# EAGLE schematic codec_AD1938 (EAGLE 9.6.2)

## Sheet 1 of 2
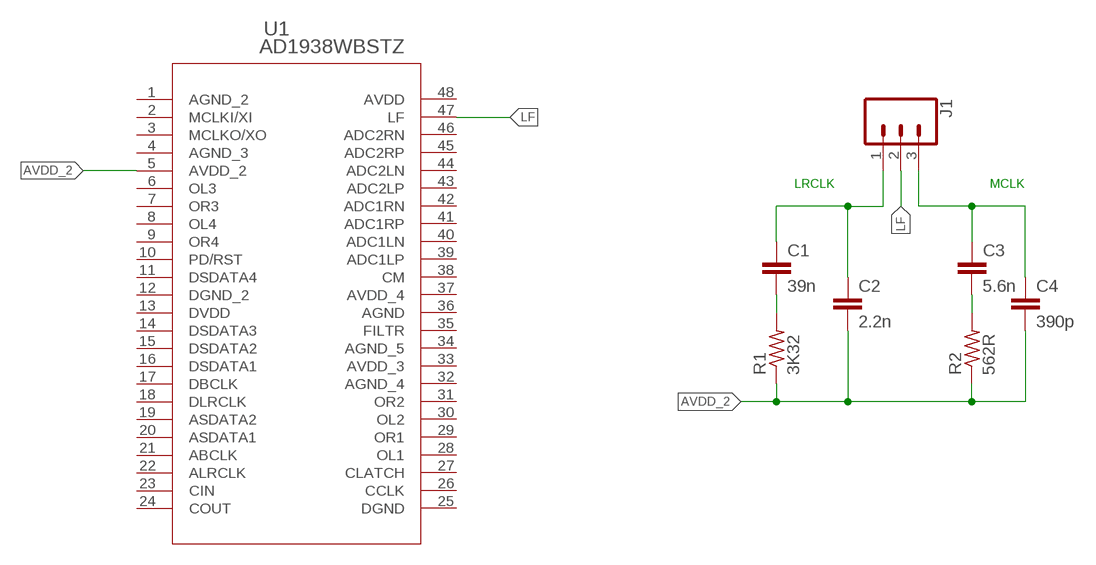
[diagram p0: schematic, sheet 1]

### Parts
C1  39n  C-EUC0603  [C0603]
C2  2.2n  C-EUC0603  [C0603]
C3  5.6n  C-EUC0603  [C0603]
C4  390p  C-EUC0603  [C0603]
J1  CONN_03LOCK_LONGPADS  [1X03_LOCK_LONGPADS]
R1  3K32  R-US_R0603  [R0603]
R2  562R  R-US_R0603  [R0603]
U1  AD1938WBSTZ  [ST_48_ADI]

### Nets
AVDD_2: C2.2 C4.2 R1.1 R2.1 U1.5(AVDD_2)
LF: C1.1 C2.1 C3.1 C4.1 J1.1 J1.2 J1.3 U1.47(LF)
N$1: C1.2 R1.2
N$4: C3.2 R2.2
Unconnected: U1.1(AGND_2) U1.2(MCLKI/XI) U1.3(MCLKO/XO) U1.4(AGND_3) U1.6(OL3) U1.7(OR3) U1.8(OL4) U1.9(OR4) U1.10(PD/RST) U1.11(DSDATA4) U1.12(DGND_2) U1.14(DSDATA3) U1.15(DSDATA2) U1.16(DSDATA1) U1.17(DBCLK) U1.18(DLRCLK) U1.19(ASDATA2) U1.20(ASDATA1) U1.21(ABCLK) U1.22(ALRCLK) U1.23(CIN) U1.24(COUT) U1.25(DGND) U1.26(CCLK) U1.27(CLATCH) U1.28(OL1) U1.29(OR1) U1.30(OL2) U1.31(OR2) U1.32(AGND_4) U1.34(AGND_5) U1.35(FILTR) U1.36(AGND) U1.38(CM) U1.39(ADC1LP) U1.40(ADC1LN) U1.41(ADC1RP) U1.42(ADC1RN) U1.43(ADC2LP) U1.44(ADC2LN) U1.45(ADC2RP) U1.46(ADC2RN)

### Notes on the sheet
- LRCLK | MCLK

## Sheet 2 of 2: DAC Output Buffers
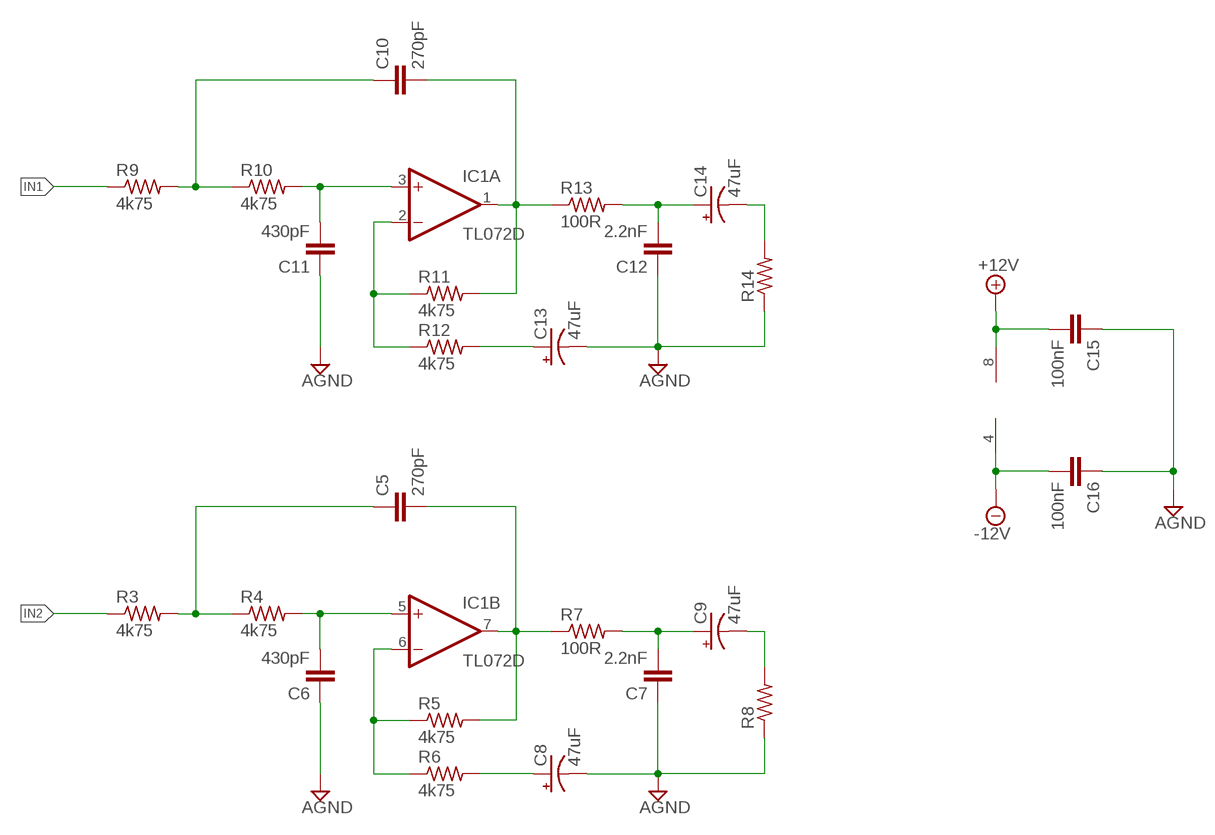
[diagram p1: schematic, sheet 2]

### Parts
C5  270pF  C-EUC0603  [C0603]
C6  430pF  C-EUC0603  [C0603]
C7  2.2nF  C-EUC0603  [C0603]
C8  47uF  CPOL-USUD-5X5,8  [UD-5X5,8_NICHICON]
C9  47uF  CPOL-USUD-5X5,8  [UD-5X5,8_NICHICON]
C10  270pF  C-EUC0603  [C0603]
C11  430pF  C-EUC0603  [C0603]
C12  2.2nF  C-EUC0603  [C0603]
C13  47uF  CPOL-USUD-5X5,8  [UD-5X5,8_NICHICON]
C14  47uF  CPOL-USUD-5X5,8  [UD-5X5,8_NICHICON]
C15  100nF  C-EUC0603  [C0603]
C16  100nF  C-EUC0603  [C0603]
IC1  TL072D  [SO08]
R3  4k75  R-US_R0603  [R0603]
R4  4k75  R-US_R0603  [R0603]
R5  4k75  R-US_R0603  [R0603]
R6  4k75  R-US_R0603  [R0603]
R7  100R  R-US_R0603  [R0603]
R8  R-US_R0603  [R0603]
R9  4k75  R-US_R0603  [R0603]
R10  4k75  R-US_R0603  [R0603]
R11  4k75  R-US_R0603  [R0603]
R12  4k75  R-US_R0603  [R0603]
R13  100R  R-US_R0603  [R0603]
R14  R-US_R0603  [R0603]

### Nets
+12V: C15.2 IC1.8(P:V+)
-12V: C16.2 IC1.4(P:V-)
AGND: C6.1 C7.1 C8.- C11.1 C12.1 C13.- C15.1 C16.1 R8.1 R14.1
IN1: R9.1
IN2: R3.1
N$2: C5.1 R3.2 R4.1
N$3: C6.2 IC1.5(B:+IN) R4.2
N$5: C5.2 IC1.7(B:OUT) R5.2 R7.1
N$6: IC1.6(B:-IN) R5.1 R6.1
N$7: C7.2 C9.+ R7.2
N$8: C9.- R8.2
N$9: C8.+ R6.2
N$10: C10.1 R9.2 R10.1
N$11: C11.2 IC1.3(A:+IN) R10.2
N$12: C10.2 IC1.1(A:OUT) R11.2 R13.1
N$13: IC1.2(A:-IN) R11.1 R12.1
N$14: C12.2 C14.+ R13.2
N$15: C13.+ R12.2
N$16: C14.- R14.2

## Power pins joined to a net without a drawn wire
AVDD: U1.48(AVDD)
AVDD_3: U1.33(AVDD_3)
AVDD_4: U1.37(AVDD_4)
DVDD: U1.13(DVDD)

## Library data of the parts
C1-C7 C10-C12 C15 C16 = rcl:C-EU: CAPACITOR, European symbol; SPICEPREFIX: C
C8 C9 C13 C14 = rcl:CPOL-US: POLARIZED CAPACITOR, American symbol; SPICEPREFIX: C
IC1 = linear:TL072: OP AMP
J1 = SparkFun-Connectors:CONN_03: Multi connection point. Often used as Generic Header-pin footprint for 0.1 inch spaced/style header connections On any of the 0.1 inch spaced packages, you can populate with these: Break Away Headers - Straight <https://www.sparkfun.com/products/116> (PRT-00116) Break Away Male Headers - Right Angle <https://www.sparkfun.com/products/553> (PRT-00553) Female Headers <https://www.sparkfun.com/products/115> (PRT-00115) Break Away Headers - Machine Pin <https://www.sparkfun.com/products/117> (PRT-00117) Break Away Female Headers - Swiss Machine Pin <https://www.sparkfun.com/products/743> (PRT-00743) Stackable Header - 3 Pin (Female, 0.1") <https://www.sparkfun.com/products/13875> (PRT-13875) For SCREWTERMINALS and SPRING TERMINALS visit here: Screw Terimnals on SparkFun.com <https://www.sparkfun.com/search/results?term=Screw+Terminals> (5mm/3.5mm/2.54mm spacing) This device is also useful as a general connection point to wire up your design to another part of your project. Our various solder wires solder well into these plated through hole pads. Hook-Up Wire - Assortment (Stranded, 22 AWG) <https://www.sparkfun.com/products/11375> (PRT-11375) Hook-Up Wire - Assortment (Solid Core, 22 AWG) <https://www.sparkfun.com/products/11367> (PRT-11367) View the entire wire category on our website here <https://www.sparkfun.com/categories/141> Special notes: Molex polarized connector foot print use with SKU : PRT-08232 with associated crimp pins and housings.
R1-R14 = rcl:R-US_: RESISTOR, American symbol; SPICEPREFIX: R
U1 = AD1938:AD1938WBSTZ; COPYRIGHT: Copyright (C) 2022 Ultra Librarian. All rights reserved.; MANUFACTURER_PART_NUMBER: AD1938WBSTZ; MFR_NAME: Analog Devices Inc